# Altium schematic sheet 01-Antennas.SchDoc
size B; SheetNumber: 1; SheetTotal: 16; SPICEModelCacheELOCFEDZ: <root> / <DocumentId>ELOCFEDZ</DocumentId> / </root>
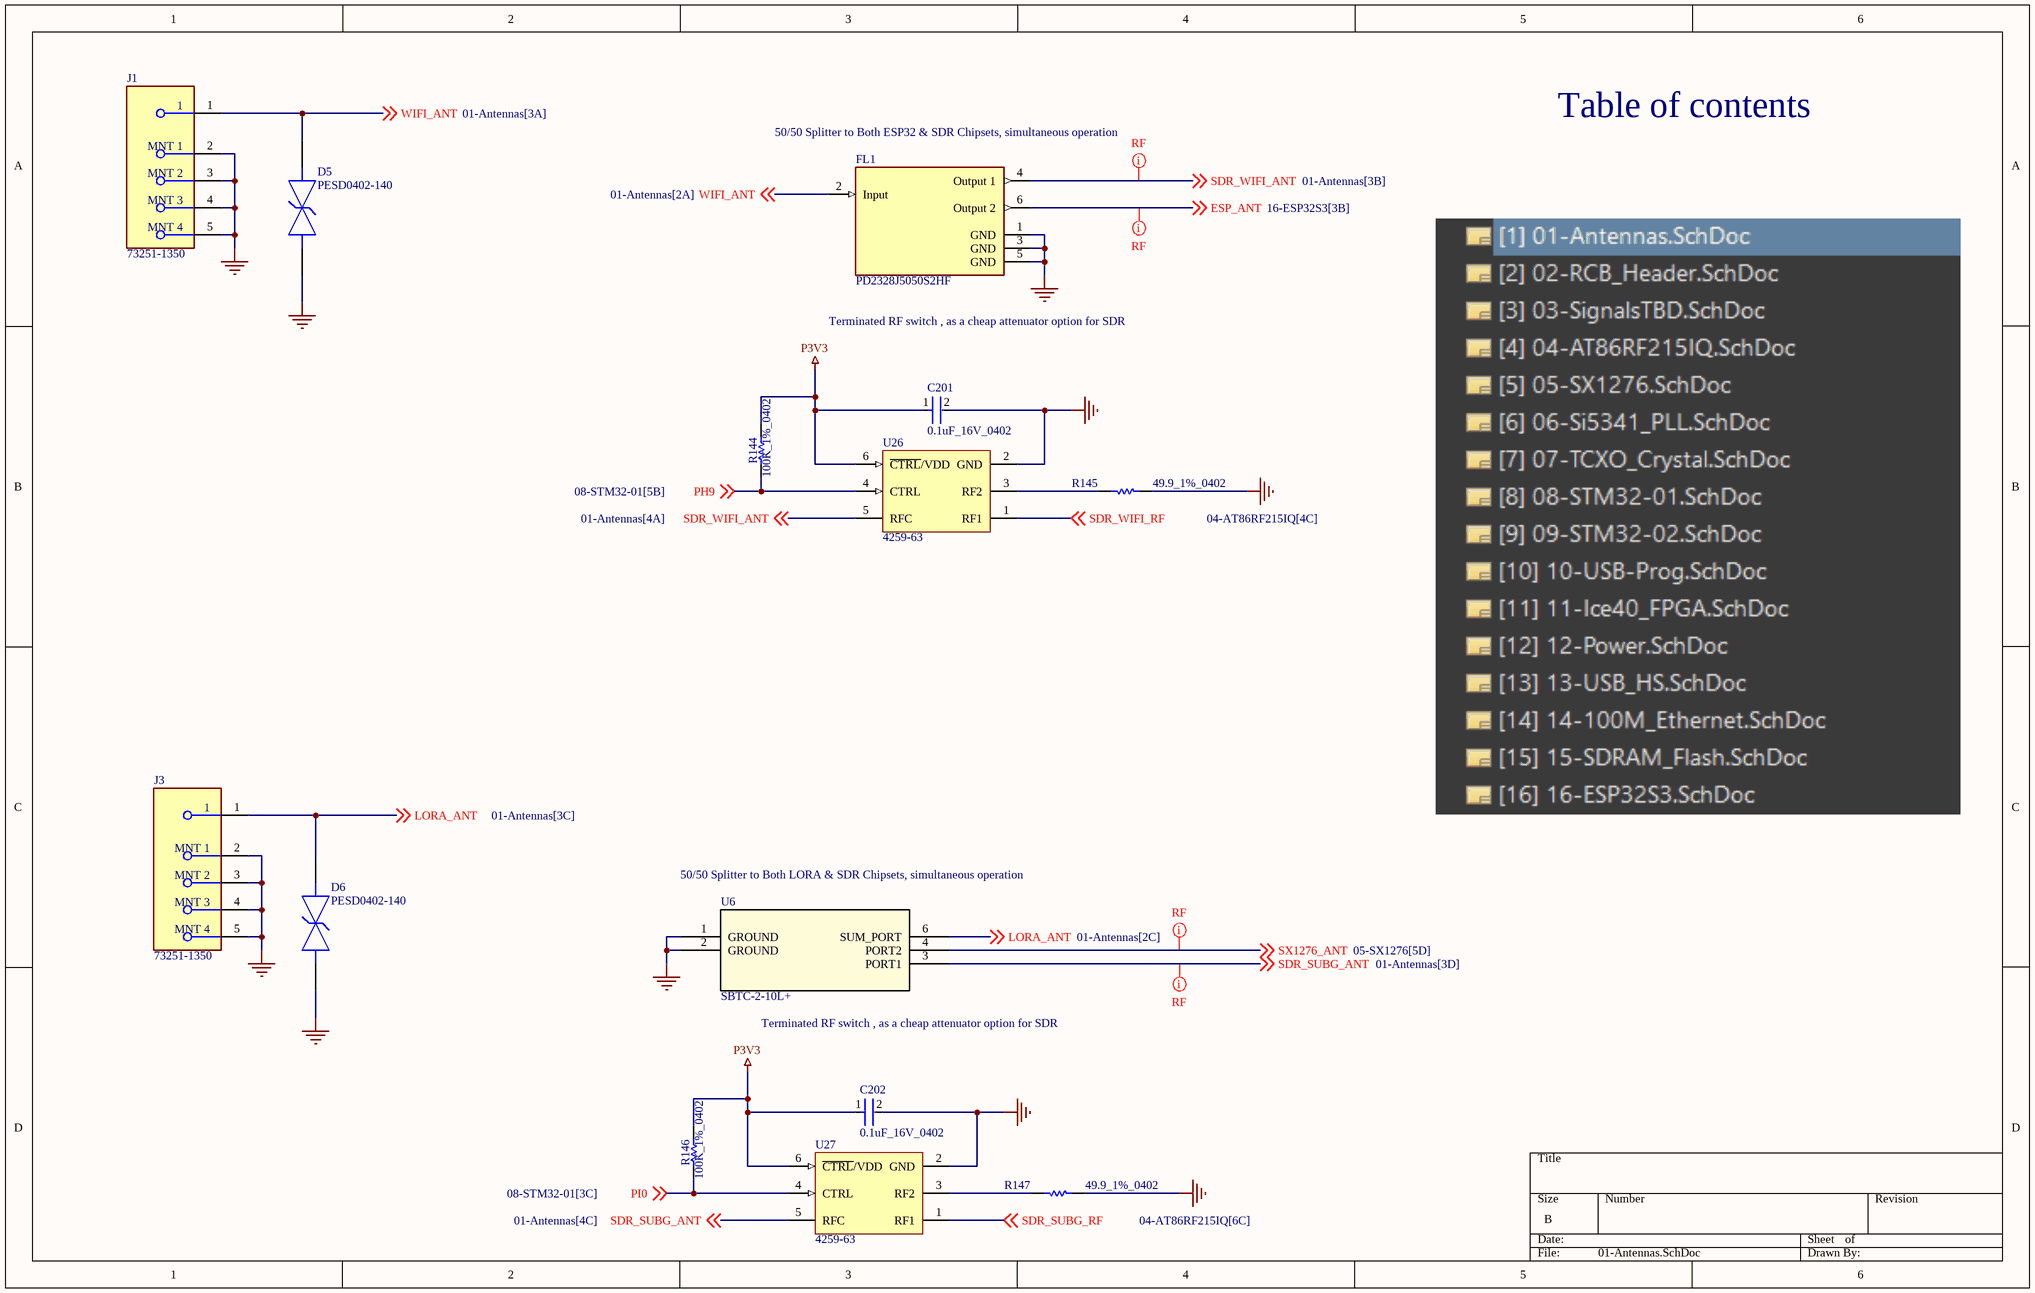
[diagram p0: 01-Antennas.SchDoc]

## Parts
C201  0.1uF_16V_0402  [FP-C0402-BB-MFG]
C202  0.1uF_16V_0402  [FP-C0402-BB-MFG]
D5  PESD0402-140  [FP-PESD0402-MFG]
D6  PESD0402-140  [FP-PESD0402-MFG]
FL1  PD2328J5050S2HF  [FP-PD2328J5050S2HF-MFG]
J1  73251-1350  [FP-73251-1350-MFG]
J3  73251-1350  [FP-73251-1350-MFG]
R144  100K_1%_0402  [RESC1005X40X25ML05T10]
R145  49.9_1%_0402  [RESC1005X40X25NL10T10]
R146  100K_1%_0402  [RESC1005X40X25ML05T10]
R147  49.9_1%_0402  [RESC1005X40X25NL10T10]
U6  SBTC-2-10L+  [AT1029_MNC]
U26  4259-63  [PERE-SC-70-6_M]
U27  4259-63  [PERE-SC-70-6_M]

## Nets
GND: C201.2 C202.2 D5.1 D6.1 FL1.1(GND) FL1.3(GND) FL1.5(GND) J1.2(MNT_1) J1.3(MNT_2) J1.4(MNT_3) J1.5(MNT_4) J3.2(MNT_1) J3.3(MNT_2) J3.4(MNT_3) J3.5(MNT_4) R145.2 R147.2 U6.1(GROUND) U6.2(GROUND) U26.2(GND) U27.2(GND)
P3V3: C201.1 C202.1 R144.2 R146.2 U26.6(~{CTRL}/VDD) U27.6(~{CTRL}/VDD)
ESP_ANT: FL1.6(Output_2) ; off-sheet ESP_ANT
LORA_ANT: D6.2 J3.1 U6.6(SUM_PORT) ; off-sheet LORA_ANT
PH9: R144.1 U26.4(CTRL) ; off-sheet PH9
PI0: R146.1 U27.4(CTRL) ; off-sheet PI0
SDR_SUBG_ANT: U6.3(PORT1) U27.5(RFC) ; off-sheet SDR_SUBG_ANT
SDR_SUBG_RF: U27.1(RF1) ; off-sheet SDR_SUBG_RF
SDR_WIFI_ANT: FL1.4(Output_1) U26.5(RFC) ; off-sheet SDR_WIFI_ANT
SDR_WIFI_RF: U26.1(RF1) ; off-sheet SDR_WIFI_RF
SX1276_ANT: U6.4(PORT2) ; off-sheet SX1276_ANT
WIFI_ANT: D5.2 FL1.2(Input) J1.1 ; off-sheet WIFI_ANT
NetR145_1: R145.1 U26.3(RF2)
NetR147_1: R147.1 U27.3(RF2)

## Layout directives
net class RF: ESP_ANT, SDR_SUBG_ANT, SDR_WIFI_ANT, SX1276_ANT

## Notes on the sheet
- (near FL1) 50/50 Splitter to Both ESP32 & SDR Chipsets, simultaneous operation
- Table of contents
- Terminated RF switch , as a cheap attenuator option for SDR
- 50/50 Splitter to Both LORA & SDR Chipsets, simultaneous operation

## Library data of the parts
C201 C202 = CMP-1034-02068-3: CAP CER 0.1UF 16V 5% X7R 0402; Manufacturer: Kemet; Manufacturer Part Number: C0402C104J4RACTU; Value: 0.10 μF; Temperature Coefficient: 15%; Tolerance: 0.05; Material: Ceramic; ComponentLink2URL: https://content.kemet.com/datasheets/KEM_C1002_X7R_SMD.pdf; Automotive: No; Device Class L2: Capacitors; Temperature: -55°C to +125°C; RoHS: TRUE; Voltage Rating: 16 V; ComponentLink2Description: Datasheet; Device Class L3: Ceramic Capacitors; Temperature Range Low: -55°C; Ipc Land Pattern Name: CAPC10050X50; Device Class L1: Passive Components; Temperature Range High: +125°C; Package: C0402-BB; Capacitance: 0.10 μF; Category: Cap; Mouser Description: CAP CER 0.1UF 16V X7R 0402; Height: 0.55mm; Digikey Description: CAP CER 0.1UF 16V 5% X7R 0402; Octopart: https://octopart.com/c0402c104j4ractu-kemet-12573893; Temperature Characteristic: X7R; Lead Free: Yes
D5 D6 = CMP-08607-000011-1: TVS DIODE 14V 40V 0402; Manufacturer: Littelfuse Inc.; Automotive Grade: Grade 1; Capacitance: 0.25pF; Value: 0.25pF; Direction: Bidirectional; Number Of Channels: 1; Temperature Range Low: -55°C; Lead Free: Yes; Temperature: -55°C to +125°C; Digikey Description: TVS DIODE 14V 40V 0402; Automotive: Yes; Device Class L2: TVS Diodes; Reverse Standoff Voltage: 14V; Device Class L1: Circuit Protection; Ipc Land Pattern Name: DIOC10050X33; Manufacturer Part Number: PESD0402-140; Breakdown Voltage: 14V; Height: 0.43mm; Clamping Voltage: 40V; RoHS: TRUE; Temperature Range High: +125°C; Device Class L3: unset; Octopart: https://octopart.com/pesd0402-140-littelfuse-74215061; Package: PESD0402; ComponentLink2URL: https://www.littelfuse.com/~/media/electronics/datasheets/polymer_esd_suppressors/littelfuse_polymer_esd_suppressor_pesd_catalog_datasheet.pdf.pdf; Category: Diode; ComponentLink2Description: Datasheet
FL1 = CMP-189356-000004-1: RF POWER DVDR 2.3GHZ-2.8GHZ 0805; Frequency: 2.8GHz; Impedance: 50R; Insertion Loss: 0.3dB; Min Operating Temperature: -55°C; Case/Package: 0805; Case Code (Metric): 2012; Width: 0.05inch; Package Quantity: 1; Radiation Hardening: No; Mount: Surface Mount; Termination: SMD/SMT; Max Operating Temperature: 85°C; Length: 0.079inch; Packaging: Tape and Reel; Number of Pins: 6; Case Code (Imperial): 0805
J1 J3 = CMP-04764-000006-1: CONN SMA JACK STR 50 OHM SMD; Manufacturer: Molex; Is Female: yes; Standoff Height: 0.41mm; Impedance: 50Ω; Number Of Contacts: 1; Conn Orientation: Straight; Voltage Rating: 500V; Shielding: true; Frequency: 18GHz; Package: 73251-1350; Device Class L1: Connectors; Category: Conn; Manufacturer Part Number: 73251-1350; ComponentLink2URL: https://www.molex.com/pdm_docs/sd/732511350_sd.pdf; Automotive: No; Height: 9.655mm; Octopart: https://octopart.com/73251-1350-molex-5414390; Footprint Url: https://forum.upverter.com/uploads/default/original/3X/d/a/daeafa2ce4908d4fc4e49f0b17d7d2c986fce444.pdf; Temperature Range High: +165°C; Device Class L3: unset; Mouser Description: RF Connectors / Coaxial Connectors SMA ST PCB-JCK STD SMT; Lead Free: Yes; Temperature: -65°C to +165°C; RoHS: TRUE; ComponentLink2Description: Datasheet; Device Class L2: RF / Coaxial Connectors; Digikey Description: CONN SMA JACK STR 50 OHM SMD; Contact Material: Gold; Temperature Range Low: -65°C
R144 R146 = CMP-2002-07852-1: Manufacturer: Yageo; Part Number: RC0402FR-13100KL
R145 R147 = CMP-2002-04448-1: Part Number: RK73H1ETTP49R9F; Manufacturer: KOA Speer
U6 = SBTC-2-10L+: No Description Available; Mfr_Name: Mini Circuits; Copyright: Copyright (C) 2023 Ultra Librarian. All rights reserved.; Manufacturer_Part_Number: SBTC-2-10L+; RefDes: RefDes; Type: DEV
U26 U27 = CMP-2000-05298-1: IC RF Switch SPDT, 50 Ohm, 6-Pin SC70, RoHS, Tape and Reel; Manufacturer: Peregrine Semiconductor; P1dB: 29dBm(typ)IP1dB; Topology: Reflective; Frequency - Upper: 3GHz; Insertion Loss @ Frequency: 0.5dB@2GHz; IIP3: 55dBm(typ); Voltage - Supply: 1.8V~3.3V; Other Names: 1046-1011-24259-63-ND425963PE4259PE4259SCBC-ZPE4259SCBC-Z-ND; Isolation @ Frequency: 20dB@2GHz(typ); Frequency - Lower: 10MHz; Online Catalog: PE4259; Impedance: 50Ohm; RF Type: GeneralPurpose; Series: UltraCMOS; Manufacturer URL: http://www.psemi.com/; Package Description: 6-Pin Small Outline Transistor, Body 2.05 x 1.25 mm, Pitch 0.65 mm; Family: RFSwitches; Packaging: Tape&Reel(TR); Features: Single/DualLineControl; Package / Case: 6-TSSOP,SC-88,SOT-363; Operating Temperature: -40degC~85degC; Circuit: SPDT; Supplier Device Package: SC-70-6; Standard Package: 3,000; Datasheet URL: https://datasheet.ciiva.com/15100/getdatasheetpartid-685660-15100501.pdf; Category: RF/IFandRFID; Datasheet Version: Jan-11; Package Reference: SC-70-6